# EasyEDA schematic RFM95 LoRa Breakout Board_2021-05-26.json
TITLE: Sheet_1; REV: 1.0; Date: 2021-05-26; Sheet: 1/1; Drawn By: sreeramaj53; Company: Your Company
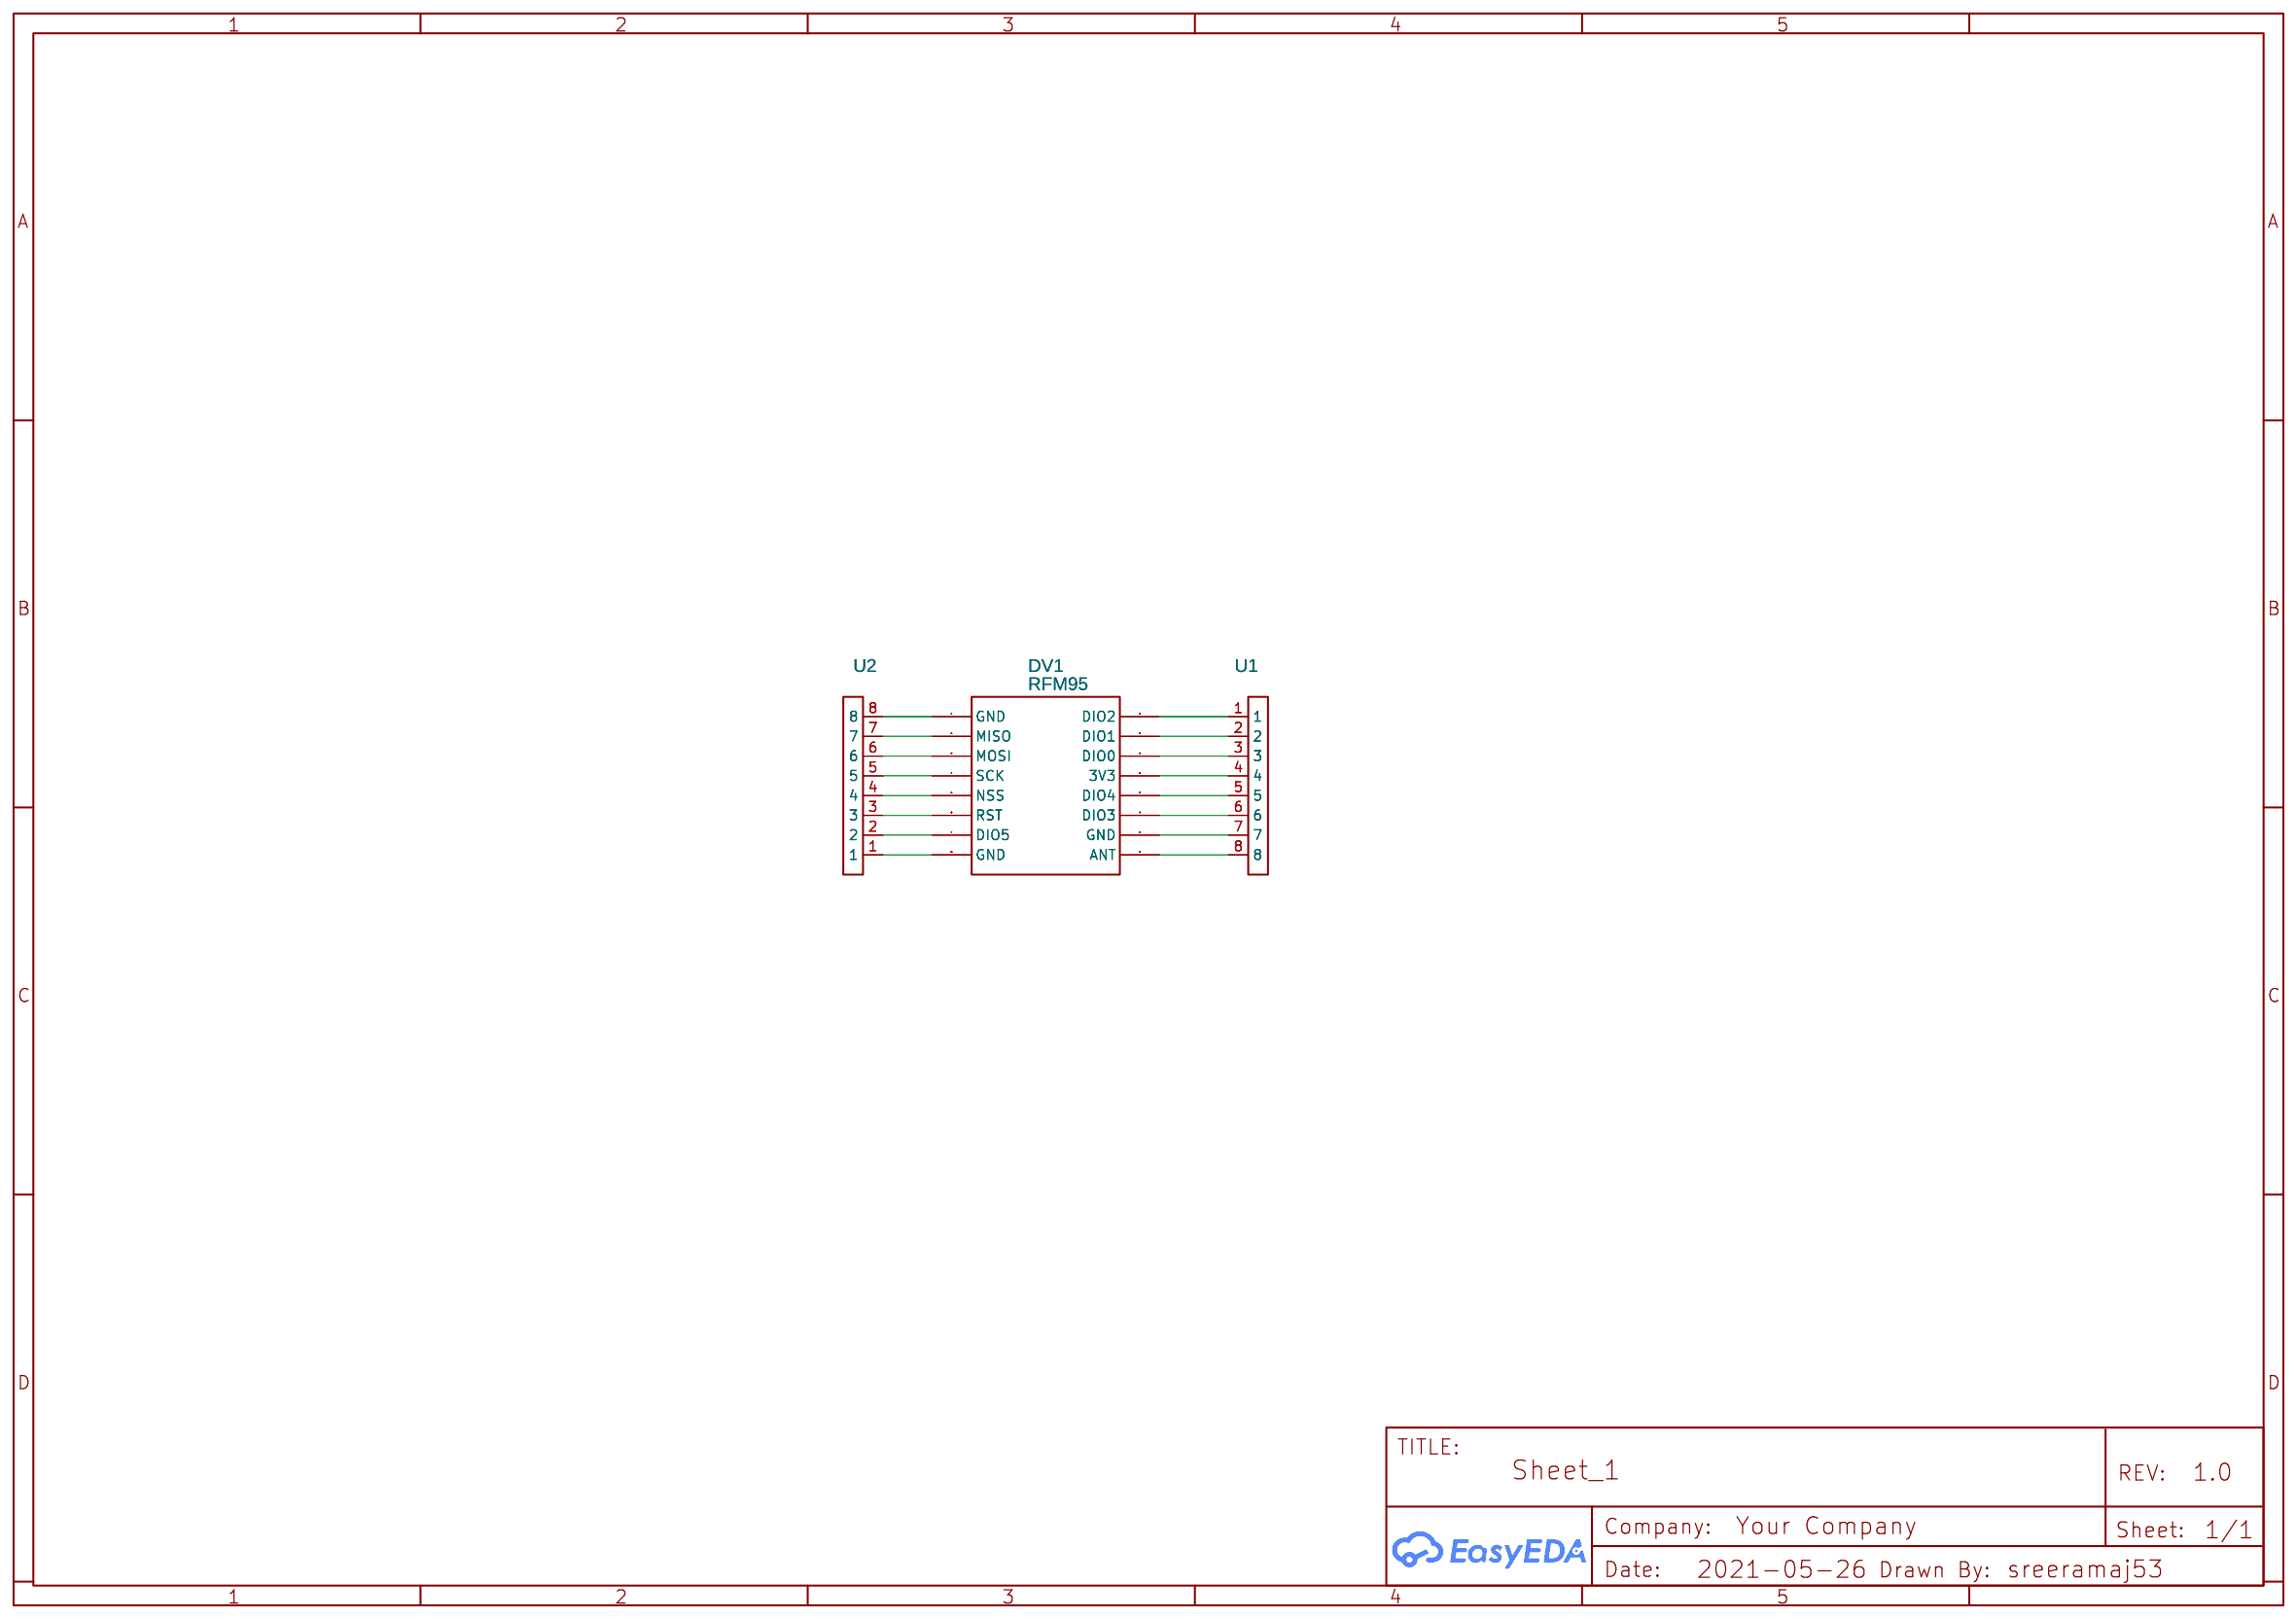
[diagram p0: schematic sheet]

## Parts
DV1  RFM95  [RFM95]
U1  8 PIN HEADER  [8 PIN HEADER]
U2  8 PIN HEADER  [8 PIN HEADER]

## Library data of the parts
DV1 = RFM95: Contributor: gsilertronics
U1 U2 = 8 PIN HEADER: Supplier Part: N/A; Manufacturer: 华宇创; Manufacturer Part: N/A; Contributor: Sander Sieglaff

## Nets
Net-(DV1-1): DV1.1(GND) U2.8
Net-(DV1-2): DV1.2(MISO) U2.7
Net-(DV1-3): DV1.3(MOSI) U2.6
Net-(DV1-4): DV1.4(SCK) U2.5
Net-(DV1-5): DV1.5(NSS) U2.4
Net-(DV1-6): DV1.6(RST) U2.3
Net-(DV1-7): DV1.7(DIO5) U2.2
Net-(DV1-8): DV1.8(GND) U2.1
Net-(DV1-9): DV1.9(ANT) U1.8
Net-(DV1-10): DV1.10(GND) U1.7
Net-(DV1-11): DV1.11(DIO3) U1.6
Net-(DV1-12): DV1.12(DIO4) U1.5
Net-(DV1-13): DV1.13(3V3) U1.4
Net-(DV1-14): DV1.14(DIO0) U1.3
Net-(DV1-15): DV1.15(DIO1) U1.2
Net-(DV1-16): DV1.16(DIO2) U1.1
